# EAGLE design counter-mega8 (EAGLE 7.4.0)
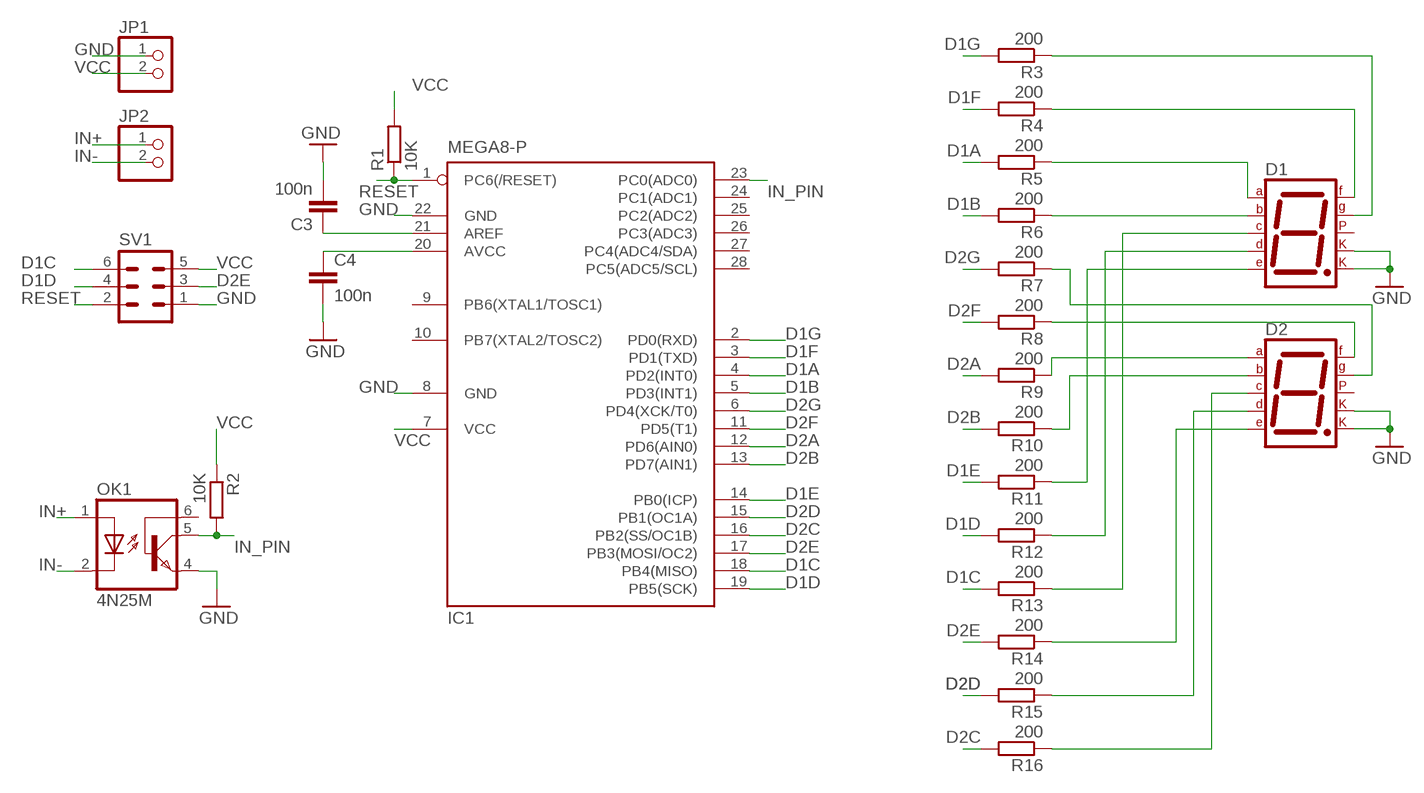
[diagram p0: schematic, sheet 1]

## Parts
C3  100n  C-EUC1206  [C1206]
C4  100n  C-EUC1206  [C1206]
D1  7SEG-CK  [7SEG-13]
D2  7SEG-CK  [7SEG-13]
IC1  MEGA8-P  [DIL28-3]
JP1  PINHD-1X2/90  [1X02/90]
JP2  PINHD-1X2/90  [1X02/90]
OK1  4N25M  [DIL06]
R1  10K  R-EU_R1206  [R1206]
R2  10K  R-EU_R1206  [R1206]
R3  200  R-EU_R1206  [R1206]
R4  200  R-EU_R1206  [R1206]
R5  200  R-EU_R1206  [R1206]
R6  200  R-EU_R1206  [R1206]
R7  200  R-EU_R1206  [R1206]
R8  200  R-EU_R1206  [R1206]
R9  200  R-EU_R1206  [R1206]
R10  200  R-EU_R1206  [R1206]
R11  200  R-EU_R1206  [R1206]
R12  200  R-EU_R1206  [R1206]
R13  200  R-EU_R1206  [R1206]
R14  200  R-EU_R1206  [R1206]
R15  200  R-EU_R1206  [R1206]
R16  200  R-EU_R1206  [R1206]
SV1  MA03-2  [MA03-2]

## Nets
AVCC: C4.1 IC1.20(AVCC)
D1A: IC1.4(PD2(INT0)) R5.2
D1B: IC1.5(PD3(INT1)) R6.2
D1C: IC1.18(PB4(MISO)) R13.2 SV1.6
D1D: IC1.19(PB5(SCK)) R12.2 SV1.4
D1E: IC1.14(PB0(ICP)) R11.2
D1F: IC1.3(PD1(TXD)) R4.2
D1G: IC1.2(PD0(RXD)) R3.2
D2A: IC1.12(PD6(AIN0)) R9.2
D2B: IC1.13(PD7(AIN1)) R10.2
D2C: IC1.16(PB2(SS/OC1B)) R16.2
D2D: IC1.15(PB1(OC1A)) R15.2
D2E: IC1.17(PB3(MOSI/OC2)) R14.2 SV1.3
D2F: IC1.11(PD5(T1)) R8.2
D2G: IC1.6(PD4(XCK/T0)) R7.2
GND: C3.2 C4.2 D1.3(CK1) D1.8(CK2) D2.3(CK1) D2.8(CK2) IC1.8(GND) IC1.22(GND) JP1.1 OK1.4(EMI) SV1.1
IN+: JP2.1 OK1.1(A)
IN-: JP2.2 OK1.2(C)
IN_PIN: IC1.23(PC0(ADC0)) OK1.5(COL) R2.2
N$2: C3.1 IC1.21(AREF)
N$5: D1.1(E) R11.1
N$6: D1.2(D) R12.1
N$7: D1.4(C) R13.1
N$8: D2.1(E) R14.1
N$9: D2.2(D) R15.1
N$10: D2.4(C) R16.1
N$11: D1.9(F) R4.1
N$12: D1.7(A) R5.1
N$13: D1.6(B) R6.1
N$14: D2.10(G) R7.1
N$15: D2.9(F) R8.1
N$16: D2.7(A) R9.1
N$17: D2.6(B) R10.1
N$18: D1.10(G) R3.1
RESET: IC1.1(PC6(/RESET)) R1.1 SV1.2
VCC: IC1.7(VCC) JP1.2 R1.2 R2.1 SV1.5
Unconnected: D1.5(DP) D2.5(DP) IC1.9(PB6(XTAL1/TOSC1)) IC1.10(PB7(XTAL2/TOSC2)) IC1.24(PC1(ADC1)) IC1.25(PC2(ADC2)) IC1.26(PC3(ADC3)) IC1.27(PC4(ADC4/SDA)) IC1.28(PC5(ADC5/SCL)) OK1.6(BAS)

## Library data of the parts
C3 C4 = rcl:C-EU: CAPACITOR, European symbol
D1 D2 = special:7SEG-CK: 7-segment DISPLAY single cathode, 13 mm
IC1 = atmel:MEGA8-P: MICROCONTROLLER 8 Kbytes FLASH, 1 kbytes SRAM, 512 bytes EEPROM, USART, 4-channel 10 bit ADC, 2-channel 8 bit ADC Pin compatible with Atmega48, ATMega88, ATMega168 Source: avr.lbr; OC_FARNELL: unknown; OC_NEWARK: unknown
JP1 JP2 = pinhead:PINHD-1X2: PIN HEADER
OK1 = optocoupler:4N*?M: General Purpose 6-Pin Phototransistor Optocouplers Source: http://www.fairchildsemi.com/ds/4N/4N35-M.pdf; MPN: 4N25-M; OC_FARNELL: 1021349; OC_NEWARK: 98K9084
R1-R16 = rcl:R-EU_: RESISTOR, European symbol
SV1 = con-lstb:MA03-2: PIN HEADER; OC_FARNELL: unknown; OC_NEWARK: unknown

## Board
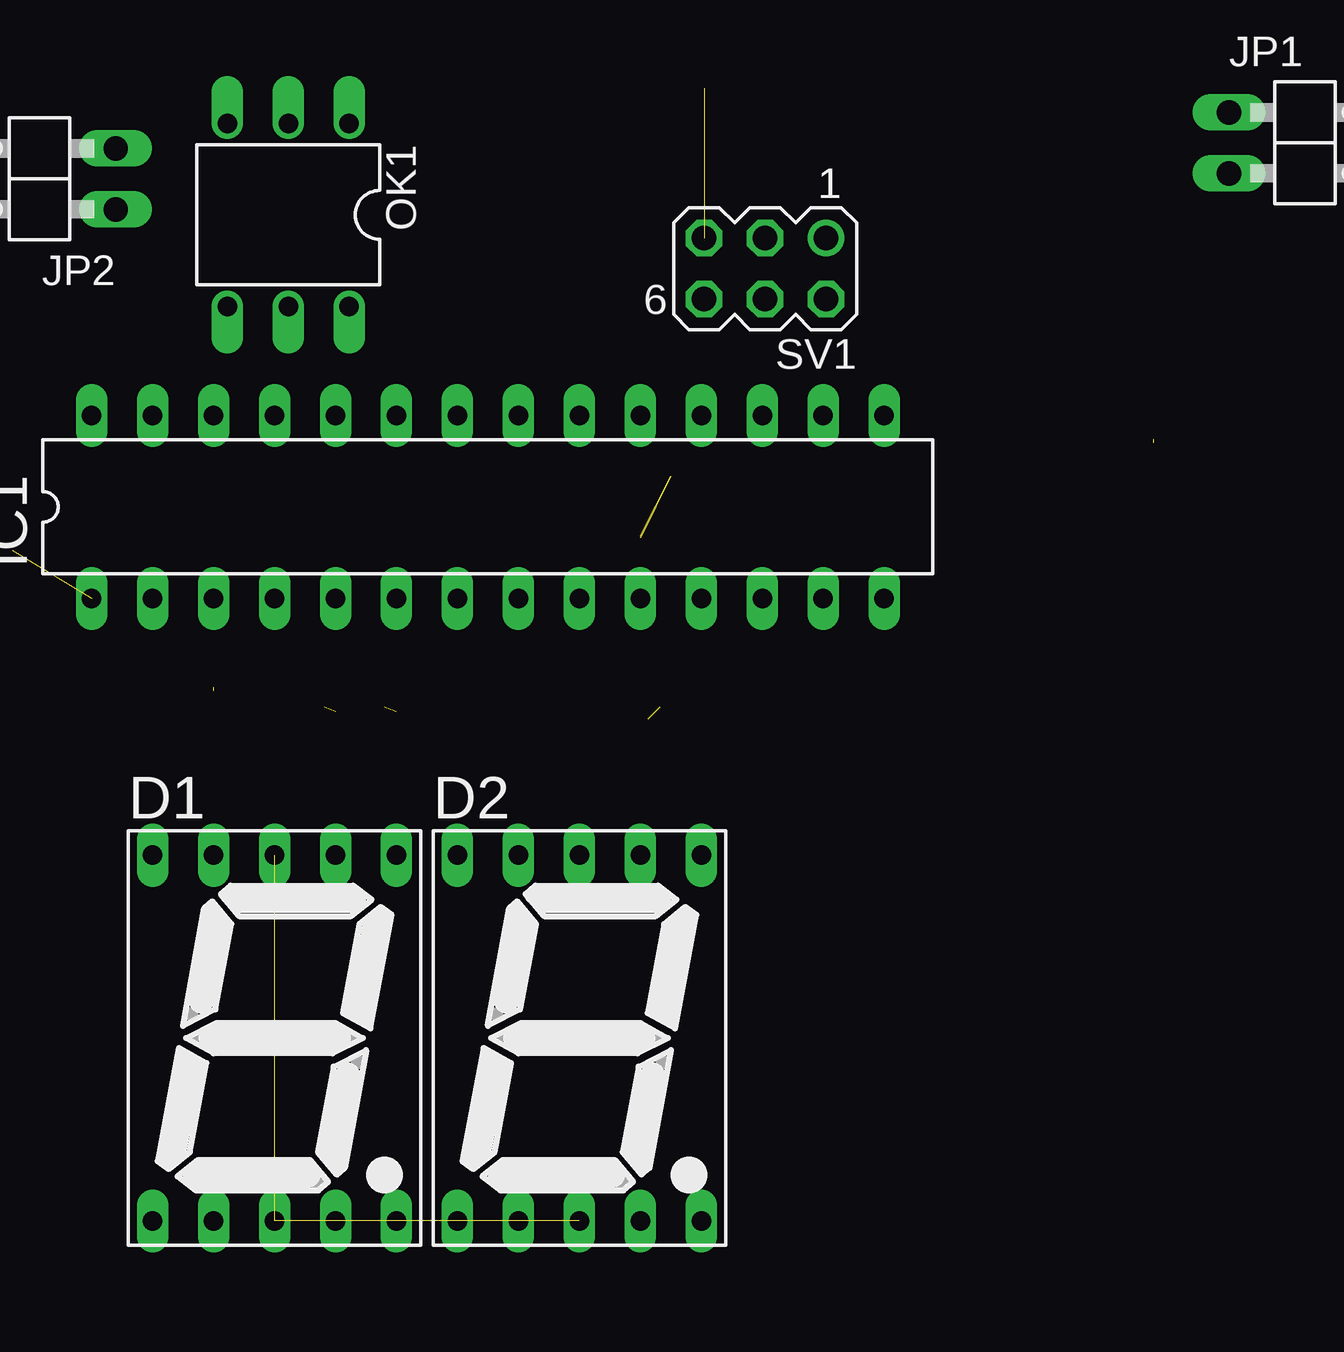
[diagram p1: board, top side]
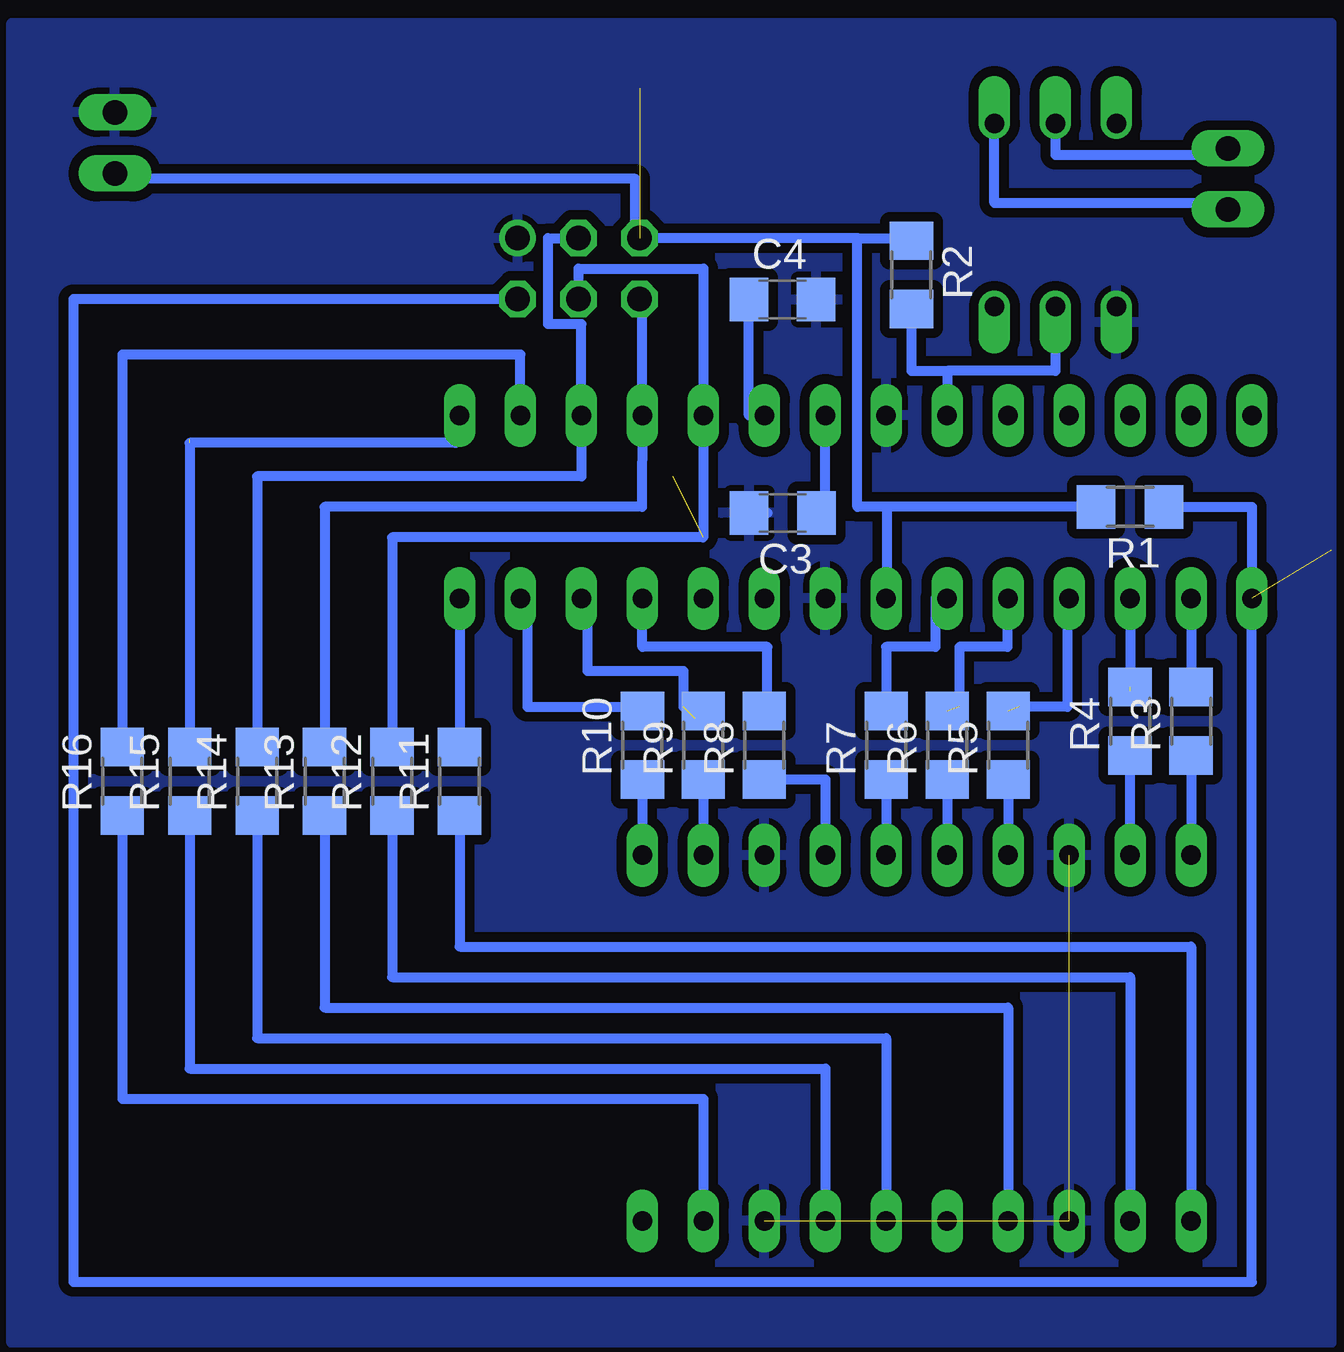
[diagram p2: board, bottom side, seen from below]

No outline drawn. Coordinates in mm, seen from the top.
Copper layers (1*16): Top 0.035mm / dielectric 1.5mm / Bottom 0.035mm
Design rules "default": minimum track width 10mil, minimum drill 24mil, track to track 8mil, track to pad 8mil, pad to pad 8mil, via to via 8mil, smd to smd 8mil, copper to edge 40mil, drill to drill 8mil, minimum pad ring 10mil, minimum via ring 8mil, stop-mask expansion 4mil, vias tented up to drill 0mil, thermal gap 10mil

### Footprints (pad centres in the part's own frame; a part is rotated, then mirrored left to right if it is on the bottom)
C1206 = smd 1.6 x 1.8: 1 -1.4,0; 2 1.4,0
7SEG-13 = drill 0.813 long: 1 -5.08,-7.62; 2 -2.54,-7.62; 3 0,-7.62; 4 2.54,-7.62; 5 5.08,-7.62; 6 5.08,7.62; 7 2.54,7.62; 8 0,7.62; 9 -2.54,7.62; 10 -5.08,7.62
DIL28-3 = drill 0.813 long: 1 -16.51,-3.81; 2 -13.97,-3.81; 3 -11.43,-3.81; 4 -8.89,-3.81; 5 -6.35,-3.81; 6 -3.81,-3.81; 7 -1.27,-3.81; 8 1.27,-3.81; 9 3.81,-3.81; 10 6.35,-3.81; 11 8.89,-3.81; 12 11.43,-3.81; 13 13.97,-3.81; 14 16.51,-3.81; 15 16.51,3.81; 16 13.97,3.81; 17 11.43,3.81; 18 8.89,3.81; 19 6.35,3.81; 20 3.81,3.81; 21 1.27,3.81; 22 -1.27,3.81; 23 -3.81,3.81; 24 -6.35,3.81; 25 -8.89,3.81; 26 -11.43,3.81; 27 -13.97,3.81; 28 -16.51,3.81
1X02/90 = drill 1.016 long: 1 -1.27,-3.81; 2 1.27,-3.81
DIL06 = drill 0.813 offset: 1 -2.54,-3.81; 2 0,-3.81; 3 2.54,-3.81; 4 2.54,3.81; 5 0,3.81; 6 -2.54,3.81
R1206 = smd 1.6 x 1.803: 1 -1.422,0; 2 1.422,0
MA03-2 = drill 1.016: 1 -2.54,-1.27 | drill 1.016 octagon: 2 -2.54,1.27; 3 0,-1.27; 4 0,1.27; 5 2.54,-1.27; 6 2.54,1.27

### Placement (x,y rotation side)
C3  22.86,34.58 180 bottom
C4  22.87,43.47 0 bottom
D1  10.93,12.7 0 top
D2  23.63,12.7 0 top
IC1  19.82,34.83 0 top
JP1  54.5,50 270 top
JP2  0.5,48.5 90 top
OK1  11.5,47 180 top
R1  8.39,34.83 180 bottom
R2  17.5,44.5 270 bottom
R3  5.85,25.9 90 bottom
R4  8.39,25.9 90 bottom
R5  13.47,24.9 90 bottom
R6  16.01,24.9 90 bottom
R7  18.55,24.9 90 bottom
R8  23.63,24.9 90 bottom
R9  26.17,24.9 90 bottom
R10  28.71,24.9 90 bottom
R11  36.33,23.4 90 bottom
R12  39.14,23.4 90 bottom
R13  41.95,23.4 90 bottom
R14  44.76,23.4 90 bottom
R15  47.57,23.4 90 bottom
R16  50.38,23.4 90 bottom
SV1  31.37,44.76 180 top

### Tracks (layer width: path | path; a pad name or v marks a point on that pad's centre or on a via)
AVCC
  Bottom 0.406: IC1.20 24.27,38.64 C4.1
D1A  (1 unrouted)
  Bottom 0.406: IC1.4 11,31.02 11,26.5 13,26.5
D1B  (1 unrouted)
  Bottom 0.406: IC1.5 13.5,31.02 13.5,29 15.5,29 15.5,26.5
D1C
  Bottom 0.406: R13.2 41.95,34.83 28.73,34.83 IC1.18 28.71,43.49 SV1.6
D1D  (3 unrouted)
  Bottom 0.406: 26.19,33.56 39.14,33.56 R12.2 | SV1.4 31.37,44.76 26.17,44.76 IC1.19 26.17,33.6
D1E
  Bottom 0.406: IC1.14 R11.2
D1F  (1 unrouted)
  Bottom 0.406: IC1.3 8.39,27.17
D1G
  Bottom 0.406: IC1.2 R3.2
D2A  (1 unrouted)
  Bottom 0.406: IC1.12 31,31.02 31,28 27,28 27,26.5 | R9.2 26,26.32 26,26.5 26.5,26.5 26.5,26
D2B
  Bottom 0.406: IC1.13 33.5,31.02 33.5,26.5 28.71,26.5 R10.2
D2C
  Bottom 0.406: IC1.16 33.79,41.18 50.38,41.18 R16.2
D2D  (1 unrouted)
  Bottom 0.406: R15.2 47.57,37.5 36.5,37.5 36.5,38.64 IC1.15
D2E
  Bottom 0.406: R14.2 44.76,36.1 31.25,36.1 IC1.17 31.25,42.45 32.64,42.45 32.64,46.03 SV1.3
D2F
  Bottom 0.406: R8.2 23.5,26.32 23.5,29 28.71,29 IC1.11
D2G
  Bottom 0.406: IC1.6 16.5,31.02 16.5,29 18.55,29 R7.2
GND  (2 unrouted)
  Bottom 0.406: C4.2 21.5,43.47 | C3.2 23.5,34.58
  pour Bottom (isolate 0.406): 0,0 55,0 55,55 0,55
IN+
  Bottom 0.406: OK1.1 14.04,47.5 4.31,47.5 JP2.1
IN-
  Bottom 0.406: OK1.2 11.5,49.5 4.31,49.5 JP2.2
IN_PIN
  Bottom 0.406: OK1.5 11.5,40.5 16.01,40.5 | R2.2 17.5,40.5 16.01,40.5 | 16.01,40.5 IC1.23
N$2
  Bottom 0.406: C3.1 21.09,34.83 IC1.21
N$5
  Bottom 0.406: R11.1 36.33,16.51 5.85,16.51 D1.1
N$6
  Bottom 0.406: R12.1 39.14,15.24 8.39,15.24 D1.2
N$7
  Bottom 0.406: R13.1 41.95,13.97 13.47,13.97 D1.4
N$8
  Bottom 0.406: R14.1 44.76,12.7 18.55,12.7 D2.1
N$9
  Bottom 0.406: R15.1 47.57,11.43 21.09,11.43 D2.2
N$10
  Bottom 0.406: R16.1 50.38,10.16 26.17,10.16 D2.4
N$11
  Bottom 0.406: D1.9 R4.1
N$12
  Bottom 0.406: R5.1 D1.7
N$13
  Bottom 0.406: R6.1 D1.6
N$14
  Bottom 0.406: R7.1 D2.10
N$15
  Bottom 0.406: R8.1 21.09,23.48 D2.9
N$16
  Bottom 0.406: R9.1 D2.7
N$17
  Bottom 0.406: R10.1 D2.6
N$18
  Bottom 0.406: R3.1 D1.10
RESET  (1 unrouted)
  Bottom 0.406: R1.1 3.31,34.83 IC1.1 3.31,2.54 52.42,2.54 52.42,43.49 SV1.2
VCC  (1 unrouted)
  Bottom 0.406: R1.2 18.5,34.83 | 18.5,34.83 19.75,34.83 19.75,46.03 | IC1.7 18.5,31.02 18.5,34.83 | 19.75,46.03 SV1.5 29,46.03 29,48.5 50.69,48.5 JP1.2 | 19.75,46.03 17.5,46.03 R2.1